# EAGLE design PCB-BI16-4 (EAGLE 7.7.0)

## Sheet 1 of 2
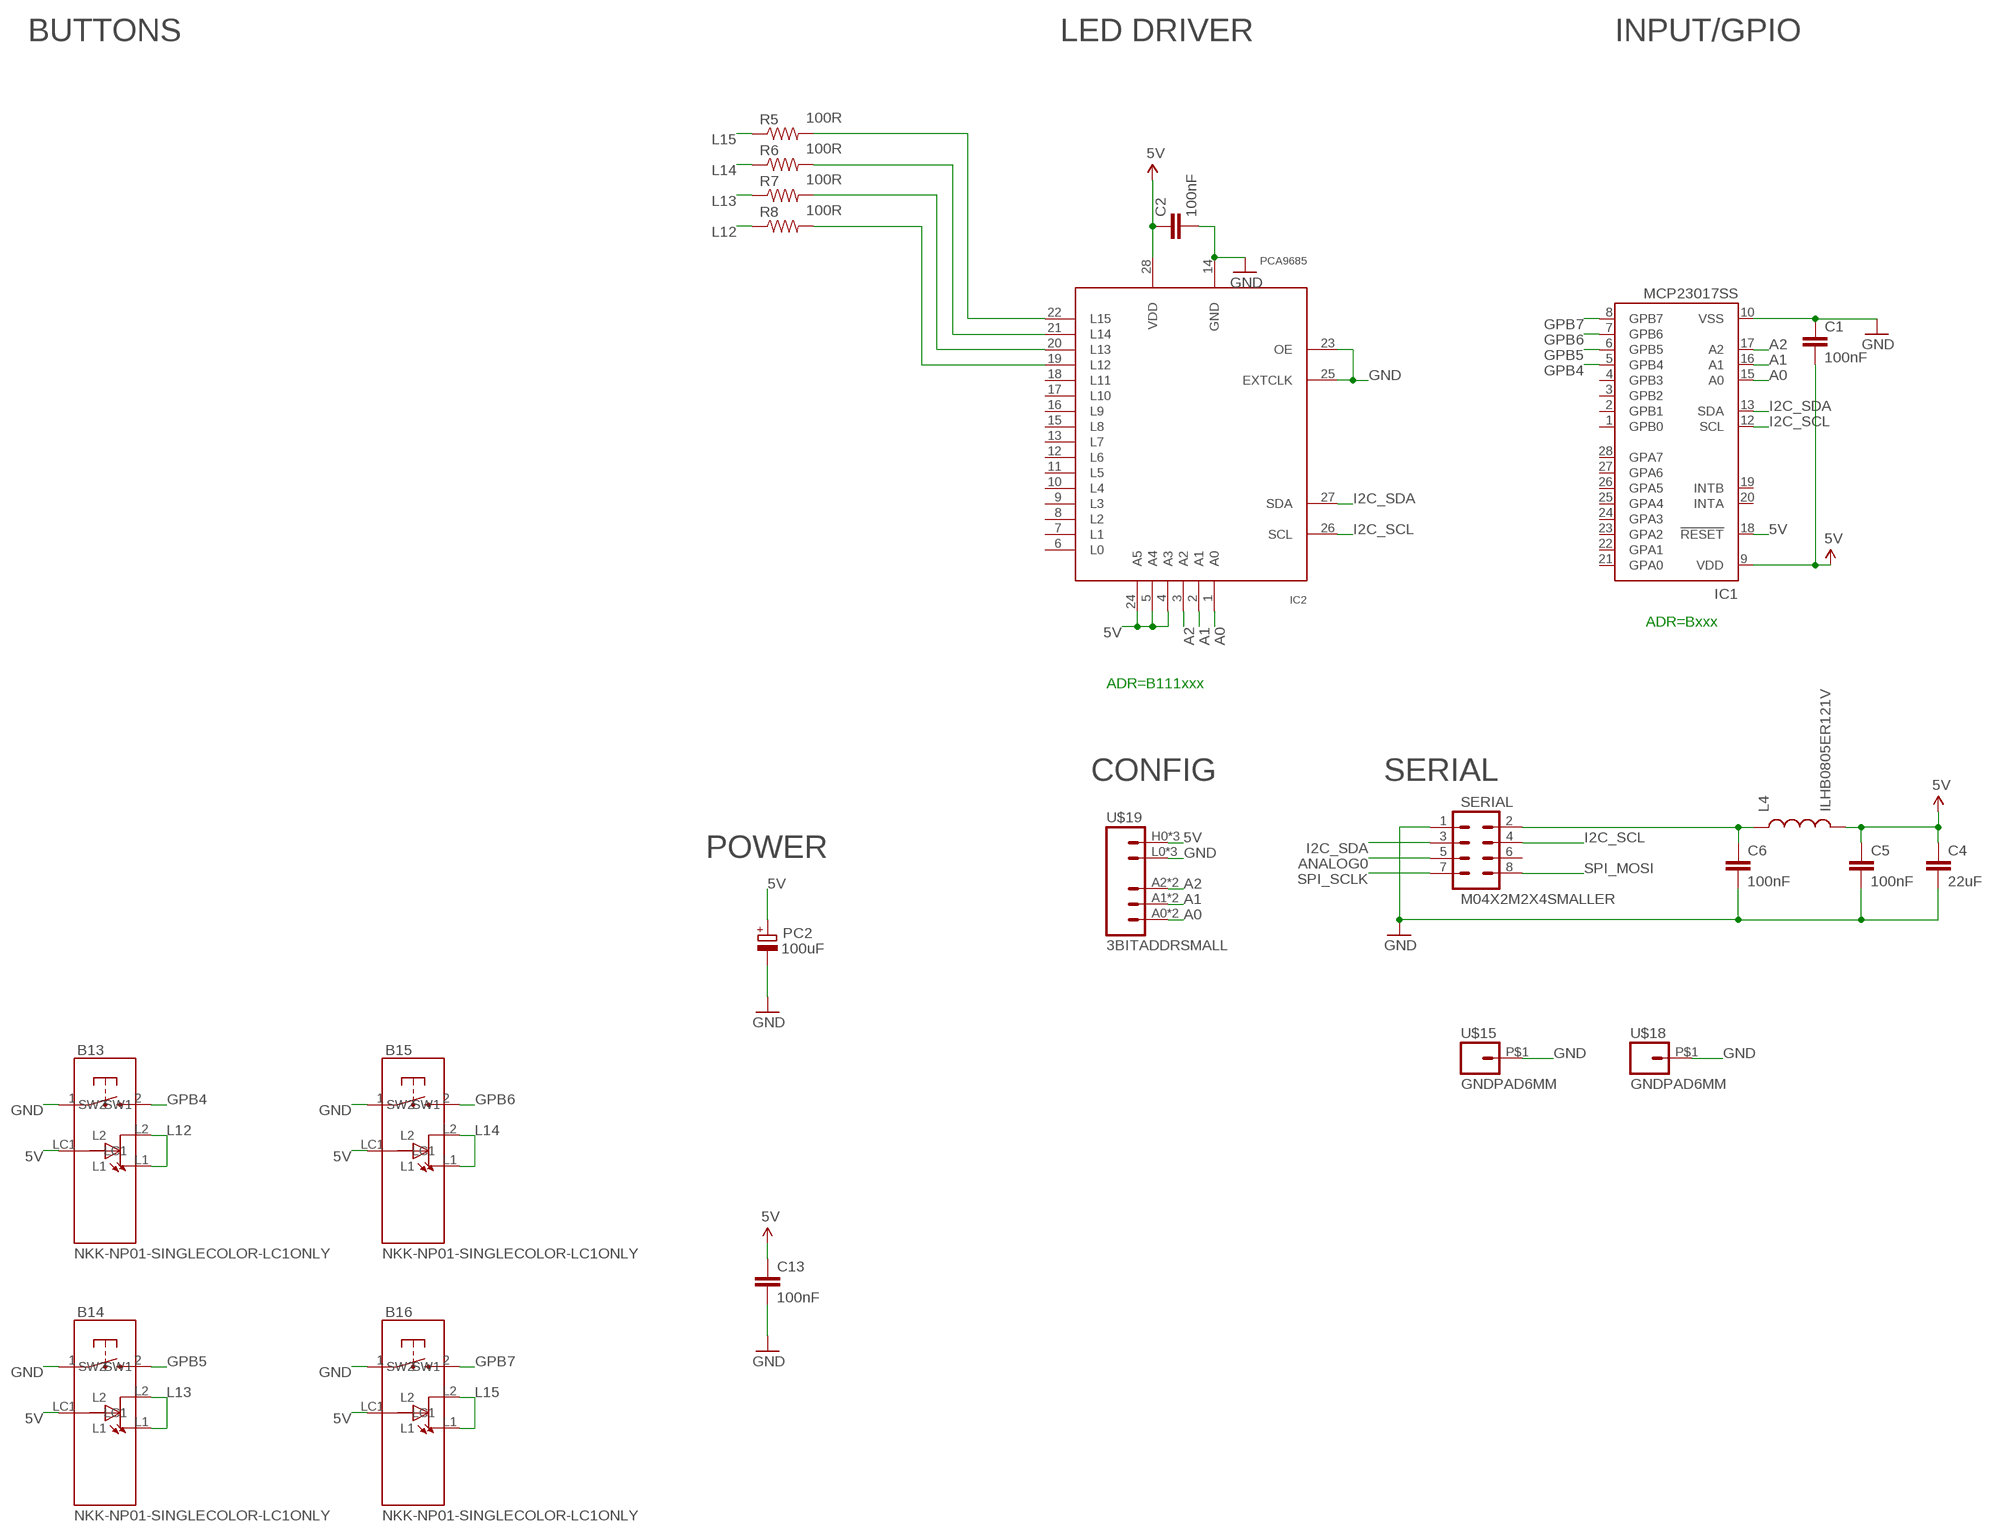
[diagram p0: schematic, sheet 1]

### Parts
B13  NKK-NP01-SINGLECOLOR-LC1ONLY  [NKK-NP01_LESSHOLES2]
B14  NKK-NP01-SINGLECOLOR-LC1ONLY  [NKK-NP01_LESSHOLES2]
B15  NKK-NP01-SINGLECOLOR-LC1ONLY  [NKK-NP01_LESSHOLES2]
B16  NKK-NP01-SINGLECOLOR-LC1ONLY  [NKK-NP01_LESSHOLES2]
C1  100nF  CAP0603-CAP  [0603-CAP]
C2  100nF  CAP0603-CAP  [0603-CAP]
C4  22uF  CAP0805  [0805]
C5  100nF  CAP0603-CAP  [0603-CAP]
C6  100nF  CAP0603-CAP  [0603-CAP]
C13  100nF  CAP0603-CAP  [0603-CAP]
IC1  MCP23017SS  [SSOP28]
IC2  PCA9685  [TSSOP28]
L4  ILHB0805ER121V  INDUCTOR0805  [0805]
PC2  100uF  CPOL-EUD  [PANASONIC_D]
R5  100R  RESISTOR0603-RES  [0603-RES]
R6  100R  RESISTOR0603-RES  [0603-RES]
R7  100R  RESISTOR0603-RES  [0603-RES]
R8  100R  RESISTOR0603-RES  [0603-RES]
SERIAL  M04X2M2X4SMALLER  [M2X4SMALLER]
U$15  GNDPAD6MM  [3.2MMPAD6MM]
U$18  GNDPAD6MM  [3.2MMPAD6MM]
U$19  3BITADDRSMALL  [3BITADDR_SMALL]

### Nets
5V [Power]: B13.LC1 B14.LC1 B15.LC1 B16.LC1 C1.2 C2.1 C4.1 C5.1 C13.1 IC1.9(VDD) IC1.18(!RESET) IC2.4(A3) IC2.5(A4) IC2.24(A5) IC2.28(VDD) L4.2 PC2.+ U$19.H0(VCC) U$19.H1(VCC) U$19.H2(VCC)
A0: IC1.15(A0) IC2.1(A0) U$19.A0 U$19.AS0(A0)
A1: IC1.16(A1) IC2.2(A1) U$19.A1 U$19.AS1(A1)
A2: IC1.17(A2) IC2.3(A2) U$19.A2 U$19.AS2(A2)
ANALOG0: SERIAL.5
GND [Power]: B13.1(SW1) B14.1(SW1) B15.1(SW1) B16.1(SW1) C1.1 C2.2 C4.2 C5.2 C6.2 C13.2 IC1.10(VSS) IC2.14(GND) IC2.23(OE) IC2.25(EXTCLK) PC2.- SERIAL.1 U$15.P$1 U$18.P$1 U$19.L0(GND) U$19.L1(GND) U$19.L2(GND)
GPB4: B13.2(SW2) IC1.5(GPB4)
GPB5: B14.2(SW2) IC1.6(GPB5)
GPB6: B15.2(SW2) IC1.7(GPB6)
GPB7: B16.2(SW2) IC1.8(GPB7)
I2C_SCL: IC1.12(SCL) IC2.26(SCL) SERIAL.4
I2C_SDA: IC1.13(SDA) IC2.27(SDA) SERIAL.3
L12: B13.L1 B13.L2 R8.1
L13: B14.L1 B14.L2 R7.1
L14: B15.L1 B15.L2 R6.1
L15: B16.L1 B16.L2 R5.1
N$1 [Power]: C6.1 L4.1 SERIAL.2
N$24: IC2.19(L12) R8.2
N$25: IC2.20(L13) R7.2
N$26: IC2.21(L14) R6.2
N$27: IC2.22(L15) R5.2
SPI_MOSI: SERIAL.8
SPI_SCLK: SERIAL.7
Unconnected: IC1.1(GPB0) IC1.2(GPB1) IC1.3(GPB2) IC1.4(GPB3) IC1.19(INTB) IC1.20(INTA) IC1.21(GPA0) IC1.22(GPA1) IC1.23(GPA2) IC1.24(GPA3) IC1.25(GPA4) IC1.26(GPA5) IC1.27(GPA6) IC1.28(GPA7) IC2.6(L0) IC2.7(L1) IC2.8(L2) IC2.9(L3) IC2.10(L4) IC2.11(L5) IC2.12(L6) IC2.13(L7) IC2.15(L8) IC2.16(L9) IC2.17(L10) IC2.18(L11) SERIAL.6

### Notes on the sheet
- BUTTONS | LED DRIVER | INPUT/GPIO
- ADR=Bxxx
- ADR=B111xxx
- CONFIG | SERIAL
- POWER

## Sheet 2 of 2

## Library data of the parts
B13-B16 = SKAARHOJ:NKK-NP01-SINGLECOLOR-LC1ONLY
C1 C2 C4-C6 C13 = SparkFun:CAP: Capacitor Standard 0603 ceramic capacitor, and 0.1" leaded capacitor.
IC1 = microchip:MCP23017: http://ww1.microchip.com/downloads/en/DeviceDoc/21952a.pdf Source: http://ww1.microchip.com/downloads/en/DeviceDoc/21952a.pdf; MF: MICROCHIP; MPN: MCP23017-E/SS; OC_FARNELL: 1467674; OC_NEWARK: 31K2960
IC2 = wsmith:PCA9685
L4 = SparkFun:INDUCTOR: Inductors Basic Inductor/Choke - 0603 and 1206. Footprints are not proven and vary greatly between part numbers.
PC2 = rcl:CPOL-EU: POLARIZED CAPACITOR, European symbol
R5-R8 = SparkFun:RESISTOR: Resistor Basic schematic elements and footprints for 0603, 1206, and PTH resistors.
SERIAL = SKAARHOJ:M04X2
U$15 U$18 = SKAARHOJ:GNDPAD
U$19 = SKAARHOJ:3BITADDR

## Net classes
0 default: width 0.203 mm, drill 0.305 mm, clearance 0.203 mm
1 Power: width 0.305 mm, drill 0.61 mm, clearance 0.254 mm

## Board
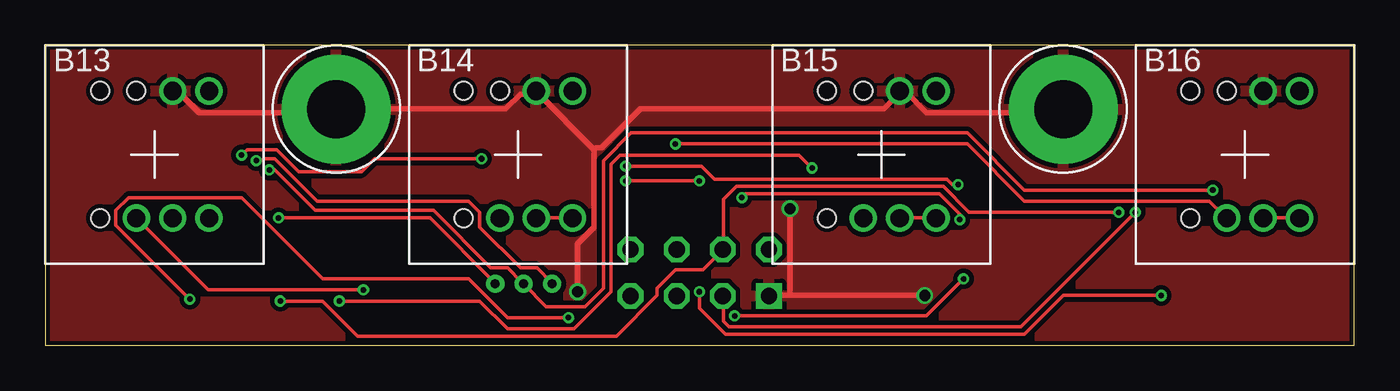
[diagram p1: board, top side]
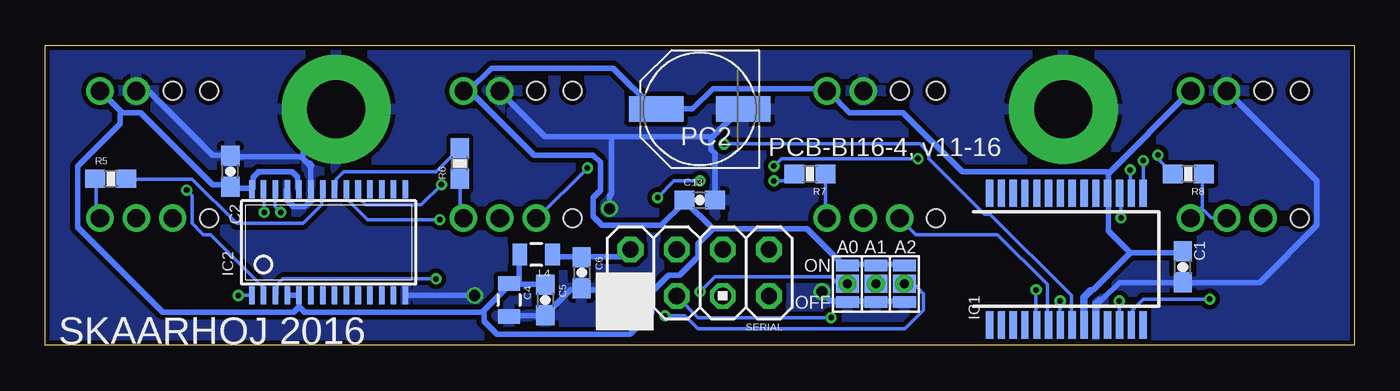
[diagram p2: board, bottom side, seen from below]

Size 72 x 16.5 mm. Coordinates in mm from the lower left corner, seen from the top.
Outline: 0,0 72,0 72,16.5 0,16.5 0,0
Copper layers (1*16): Top 0.035mm / dielectric 1.5mm / Bottom 0.035mm
Design rules "Fusion_eagle_rule_v1.1": minimum track width 6mil, minimum drill 12mil, track to track 6mil, track to pad 6mil, pad to pad 6mil, via to via 6mil, smd to smd 0mil, copper to edge 10mil, drill to drill 10mil, minimum pad ring 10mil, minimum via ring 6mil, stop-mask expansion 2mil, vias tented up to drill 100mil, thermal gap 10mil

### Footprints (pad centres in the part's own frame; a part is rotated, then mirrored left to right if it is on the bottom)
NKK-NP01_LESSHOLES2 = drill 1: 1 1,3.5; 2 -1,-3.5; L1 3,-3.5; L2 1,-3.5; LC1 3,3.5 | hole 1: -3,3.5; -3,-3.5; -1,3.5
0603-CAP = smd 1.1 x 1: 1 -0.85,0; 2 0.85,0
0805 = smd 0.8 x 1.2: 1 -0.9,0; 2 0.9,0
SSOP28 = smd 0.4 x 1.5: 1 -4.225,-3.625; 2 -3.575,-3.625; 3 -2.925,-3.625; 4 -2.275,-3.625; 5 -1.625,-3.625; 6 -0.975,-3.625; 7 -0.325,-3.625; 8 0.325,-3.625; 9 0.975,-3.625; 10 1.625,-3.625; 11 2.275,-3.625; 12 2.925,-3.625; 13 3.575,-3.625; 14 4.225,-3.625; 15 4.225,3.625; 16 3.575,3.625; 17 2.925,3.625; 18 2.275,3.625; 19 1.625,3.625; 20 0.975,3.625; 21 0.325,3.625; 22 -0.325,3.625; 23 -0.975,3.625; 24 -1.625,3.625; 25 -2.275,3.625; 26 -2.925,3.625; 27 -3.575,3.625; 28 -4.225,3.625
TSSOP28 = smd 0.305 x 0.991: 1 -4.225,-2.918; 2 -3.575,-2.918; 3 -2.925,-2.918; 4 -2.275,-2.918; 5 -1.625,-2.918; 6 -0.975,-2.918; 7 -0.325,-2.918; 8 0.325,-2.918; 9 0.975,-2.918; 10 1.625,-2.918; 11 2.275,-2.918; 12 2.925,-2.918; 13 3.575,-2.918; 14 4.225,-2.918; 15 4.225,2.918; 16 3.575,2.918; 17 2.925,2.918; 18 2.275,2.918; 19 1.625,2.918; 20 0.975,2.918; 21 0.325,2.918; 22 -0.325,2.918; 23 -0.975,2.918; 24 -1.625,2.918; 25 -2.275,2.918; 26 -2.925,2.918; 27 -3.575,2.918; 28 -4.225,2.918
PANASONIC_D = smd 3 x 1.4: + 2.4,0; - -2.4,0
0603-RES = smd 1.1 x 1: 1 -0.85,0; 2 0.85,0
M2X4SMALLER = drill 0.9 square: 1 -1.27,3.81 | drill 0.9 octagon: 2 1.27,3.81; 3 -1.27,1.27; 4 1.27,1.27; 5 -1.27,-1.27; 6 1.27,-1.27; 7 -1.27,-3.81; 8 1.27,-3.81
3.2MMPAD6MM = drill 3.2 pad 6: P$1 0,0
3BITADDR_SMALL = drill 0.5: A0 -1.565,0; A1 0,0; A2 1.565,0 | smd 1.27 x 1: AS0 -1.565,0; AS1 0,0; AS2 1.565,0 | smd 1.27 x 0.635: H0 -1.565,1; H1 0,1; H2 1.565,1; L0 -1.565,-1; L1 0,-1; L2 1.565,-1

### Placement (x,y rotation side)
B13  6,10.5 0 top
B14  26,10.5 0 top
B15  46,10.5 0 top
B16  66,10.5 0 top
C1  9.42,4.33 90 bottom
C2  61.82,9.58 90 bottom
C4  46.5,2.5 270 bottom
C5  44.5,2.5 270 bottom
C6  42.5,4 270 bottom
C13  36,8 0 bottom
IC1  15.83,4.75 0 bottom
IC2  56.42,5.67 0 bottom
L4  45,5 180 bottom
PC2  36,13 180 bottom
R5  68.4,9.18 0 bottom
R6  49.2,10.01 90 bottom
R7  29.93,9.43 180 bottom
R8  9.12,9.43 180 bottom
SERIAL  36,4 90 bottom
U$15  16,13 0 top
U$18  56,13 0 top
U$19  26.31,3.39 0 bottom

### Tracks (layer width: path | path; a pad name or v marks a point on that pad's centre or on a via)
5V
  Bottom 0.305: 12.31,5.09 9.47,5.09 C1.2 | 12.31,5.09 14.34,3.05 14.5,3 | 12.31,5.09 13.53,6.31 13.53,8.34 IC1.18 13.53,8.44 13.53,9.46 | 13.53,9.46 9.06,13.93 B13.LC1 | 13.53,9.46 13.63,9.56 21.56,9.56 24.81,12.81 27.75,12.81 28.87,13.93 B14.LC1 29.08,14.03 29.18,14.13 35.27,14.13 36.39,13.01 38.32,13.01 PC2.+ 38.52,13.01 40.76,15.25 47.47,15.25 48.69,14.03 48.99,14.03 B15.LC1 48.58,13.93 45.13,10.47 41.88,10.47 41.47,10.06 41.47,8.54 41.88,8.13 41.88,7.12 41.37,6.61 38.12,6.61 36.9,7.83 C13.1 36.8,7.93 35.27,6.41 | IC2.24 58.13,8.64 58.13,9.25 58.44,9.56 60.27,9.56 60.57,9.25 60.57,8.64 IC2.28 60.77,8.64 61.79,8.64 C2.1 61.89,8.85 62.81,8.85 66.77,12.81 67.79,12.81 | 67.79,12.81 68.9,13.93 B16.LC1 | U$19.H2 24.81,4.48 26.23,4.48 U$19.H1 26.43,4.48 27.75,4.48 U$19.H0 27.96,4.48 28.16,4.48 30.09,6.41 35.27,6.41 | IC2.4 58.64,2.75 58.13,2.75 IC2.5 58.03,2.65 58.03,2.14 | C5.1 44.52,3.36 46.45,3.36 C4.1 | L4.2 45.94,4.99 45.94,3.46 C4.1 | 58.03,2.14 57.73,1.83 47.97,1.83 | 47.97,1.83 46.55,3.26 C4.1 | 35.27,6.41 36.09,5.59 36.09,4.88 37.1,3.87 37.71,3.87 38.63,2.95 38.63,1.83 39.85,0.62 47.16,0.62 47.87,1.33 47.87,1.73 47.97,1.83 | 58.03,2.14 58.34,1.83 65.55,1.83 70.22,6.51 70.22,9.86 67.89,12.2 67.89,12.71 67.79,12.81
  Bottom 0.406: IC1.9 14.86,2.64 14.5,3
A0  (via drill 0.3)
  Top 0.203: v11.6,10.17 11.91,10.17 12.01,10.27 12.62,10.27 14.95,7.93 23.29,7.93 23.89,7.32 23.89,6.51 26.13,4.27 27.04,4.27 27.86,3.46 U$19.AS0 | v61.38,2.75 56,2.75 53.87,0.62 37.41,0.62 35.98,2.04 v35.98,2.95
  Bottom 0.203: v11.6,10.17 11.6,8.44 IC1.15 | v61.38,2.75 60.67,2.75 IC2.1 | v35.98,2.95 35.17,3.77 28.77,3.77 28.47,3.46 27.96,3.46 U$19.AS0
A1  (via drill 0.3)
  Top 0.203: v64.23,8.54 53.87,8.54 50.72,11.69 32.23,11.69 30.7,10.17 30.7,3.16 29.69,2.14 27.55,2.14 26.33,3.36 U$19.AS1 26.23,3.46 25.42,4.27 24.5,4.27 21.35,7.42 14.85,7.42 12.62,9.66 v12.31,9.66
  Bottom 0.203: v64.23,8.54 63.92,8.24 63.92,6.71 63.31,6.1 62.91,6.1 60.06,3.26 60.06,2.85 IC2.2 | 26.33,3.46 U$19.AS1 | v12.31,9.66 12.31,8.44 IC1.16
A2  (via drill 0.3)
  Top 0.203: v12.82,7.02 21.15,7.02 24.71,3.46 U$19.AS2 | v50.51,3.66 48.48,1.63 v37.91,1.63
  Bottom 0.203: v12.82,7.02 12.82,8.34 IC1.17 | v50.51,3.66 58.95,3.66 59.25,3.36 59.25,2.85 IC2.3 | v37.91,1.63 36.8,1.63 36.09,0.92 24.71,0.92 23.69,1.94 23.69,2.85 24.2,3.36 24.71,3.36 U$19.AS2 24.81,3.46
GND  (via drill 0.61)
  Top 0.305: v29.28,2.95 29.28,5.59 30.19,6.51 30.19,10.78 | 30.19,10.78 27.04,13.93 B14.1 26.94,13.82 26.13,13.82 25.32,13.01 16.07,13.01 U$15.P$1 15.87,12.91 15.77,12.81 8.45,12.81 7.33,13.93 7.03,13.93 B13.1 | 40.96,2.75 39.85,2.75 SERIAL.1 | 40.96,2.75 v48.38,2.75 | U$18.P$1 56,12.91 55.9,12.81 48.48,12.81 47.36,13.93 47.06,13.93 B15.1 46.96,13.82 46.15,13.01 32.73,13.01 30.6,10.88 30.3,10.88 30.19,10.78 | v40.96,7.53 40.96,2.75
  Bottom 0.305: 57.4,9.9 IC2.23 57.42,8.44 57.42,7.93 57.73,7.63 58.34,7.63 58.74,8.03 58.74,8.54 IC2.25 | 14,2.5 13.84,2.55 12.92,3.46 9.47,3.46 C1.1 9.26,3.46 5.2,3.46 2.05,6.61 2.05,9.05 6.93,13.93 B13.1 | U$19.L2 24.81,2.44 26.23,2.44 U$19.L1 26.43,2.44 27.86,2.44 U$19.L0 27.96,2.44 28.77,2.44 v29.28,2.95 | 57.93,10.37 61.79,10.37 C2.2 61.89,10.47 62.81,10.47 66.26,13.93 66.97,13.93 B16.1 | 57.93,10.37 57.63,10.06 57.5,10 | C4.2 46.45,1.63 44.52,1.63 C5.2 44.42,1.73 43.1,3.05 42.59,3.05 C6.2 42.39,3.05 40.15,3.05 39.85,2.75 SERIAL.1 | v48.38,2.75 52.14,2.75 IC2.14 | 35.38,11.39 35.38,10.78 35.17,10.57 35.17,8.03 C13.2 | 35.38,11.39 33.85,12.91 33.65,12.91 PC2.- | 40.86,11.49 44.52,11.49 46.96,13.93 B15.1 | 40.86,11.49 35.48,11.49 35.38,11.39 | v40.96,7.53 40.96,8.24 40.86,8.34 40.86,11.49 | 57.93,10.37 57.83,10.47 57.83,11.08 56,12.91 U$18.P$1
  Bottom 0.406: IC1.10 14.21,2.29 14,2.5 | 57.4,9.9 57.5,10
  pour Top: 0,0 72.5,0 72.5,16.5 0,16.5
  pour Bottom: 0,0 72.5,0 72.5,16.5 0,16.5
GPB4  (via drill 0.3)
  Top 0.203: v17.49,3.05 8.96,3.05 5.1,6.92 B13.2
  Bottom 0.203: v17.49,3.05 17.49,1.23 IC1.5
GPB5
  Bottom 0.203: IC1.6 16.88,1.23 16.88,3.36 19.63,6.1 24.1,6.1 24.91,6.92 B14.2
GPB6  (via drill 0.3)
  Top 0.203: v16.17,2.44 23.89,2.44 25.42,0.92 29.08,0.92 31.11,2.95 31.11,9.96 31.62,10.47 41.47,10.47 v42.18,9.76
  Bottom 0.203: v16.17,2.44 16.17,1.23 IC1.7 | v42.18,9.76 44.93,7.02 B15.2
GPB7  (via drill 0.3)
  Top 0.203: v34.66,11.08 50.72,11.08 53.87,7.93 64.03,7.93 64.94,7.02 B16.2
  Bottom 0.203: v34.66,11.08 23.89,11.08 23.39,10.57 23.39,10.27 20.34,7.22 20.03,7.22 15.56,2.75 15.56,1.23 IC1.8
I2C_SCL  (via drill 0.3)
  Top 0.203: v59.05,7.32 50.82,7.32 49.4,8.74 38.02,8.74 37.31,8.03 37.31,5.29 SERIAL.4 37.2,5.19 36.19,4.17 34.66,4.17 33.65,3.16 33.65,2.75 31.41,0.51 17.19,0.51 15.26,2.44 v12.92,2.44
  Bottom 0.203: v59.05,7.32 59.35,7.63 59.35,8.54 IC2.26 | v12.92,2.44 12.92,1.23 IC1.12
I2C_SDA  (via drill 0.3)
  Top 0.203: v59.96,7.32 53.66,1.02 37.61,1.02 37.31,1.33 37.31,2.65 SERIAL.3 | v7.94,2.55 3.88,6.61 3.88,7.42 4.59,8.13 10.79,8.13 15.26,3.66 23.29,3.66 25.42,1.53 v28.77,1.53
  Bottom 0.203: v59.96,7.32 59.96,8.54 IC2.27 | v7.94,2.55 11.6,2.55 12.21,1.94 12.21,1.23 IC1.13 | v28.77,1.53 36.09,1.53 37.2,2.65 SERIAL.3
L12
  Bottom 0.203: 8.4,7.58 8.96,7.02 B13.L1 | 8.4,7.58 8.35,7.63 8.35,9.35 R8.1 | 8.4,7.58 7.84,7.02 7.03,7.02 B13.L2
L13
  Top 0.203: B14.L2 27.04,7.02 28.97,7.02 B14.L1
  Bottom 0.203: R7.1 29.08,9.35 29.08,7.02 B14.L1
L14
  Top 0.203: B15.L2 47.06,7.02 48.99,7.02 B15.L1
  Bottom 0.203: R6.1 49.19,7.12 49.09,7.02 B15.L1
L15
  Top 0.203: B16.L2 67.07,7.02 68.9,7.02 B16.L1
  Bottom 0.203: R5.1 69.21,9.15 69.21,7.22 69,7.02 B16.L1
N$1
  Bottom 0.305: L4.1 44.01,4.99 43.91,4.88 42.59,4.88 C6.1 42.39,4.88 40.15,4.88 39.85,5.19 SERIAL.2
N$24  (via drill 0.3)
  Top 0.203: v50.21,8.85 49.9,8.85 49.6,9.15 36.8,9.15 36.09,9.86 v31.92,9.86 | v24,10.27 18.1,10.27 17.39,9.56 13.94,9.56 12.72,10.78 11.09,10.78 v10.79,10.47
  Bottom 0.203: v50.21,8.85 51.33,7.73 54.37,7.73 54.78,8.13 54.78,8.54 IC2.19 | v31.92,9.86 31.51,10.27 v24,10.27 | v10.79,10.47 10.79,10.27 9.97,9.46 R8.2
N$25  (via drill 0.3)
  Top 0.203: v50.31,6.92 50.31,7.22 49.19,8.34 38.52,8.34 v38.32,8.13 | v31.92,9.05 v35.98,9.05
  Bottom 0.203: v50.31,6.92 54.27,6.92 55.39,8.03 55.39,8.54 IC2.20 | v38.32,8.13 37.41,9.05 v35.98,9.05 | v31.92,9.05 31.11,9.05 30.8,9.35 R7.2
N$26
  Bottom 0.203: IC2.21 56,8.64 56,9.15 55.59,9.56 50.51,9.56 49.29,10.78 R6.2
N$27
  Bottom 0.203: IC2.22 56.81,8.54 56.81,7.73 57.83,6.71 61.49,6.71 63.92,9.15 67.48,9.15 R5.2

### Text on the board
_bsilk: PCB-BI16-4, v11-16 | SKAARHOJ 2016